# EAGLE design Top (EAGLE 6.1)
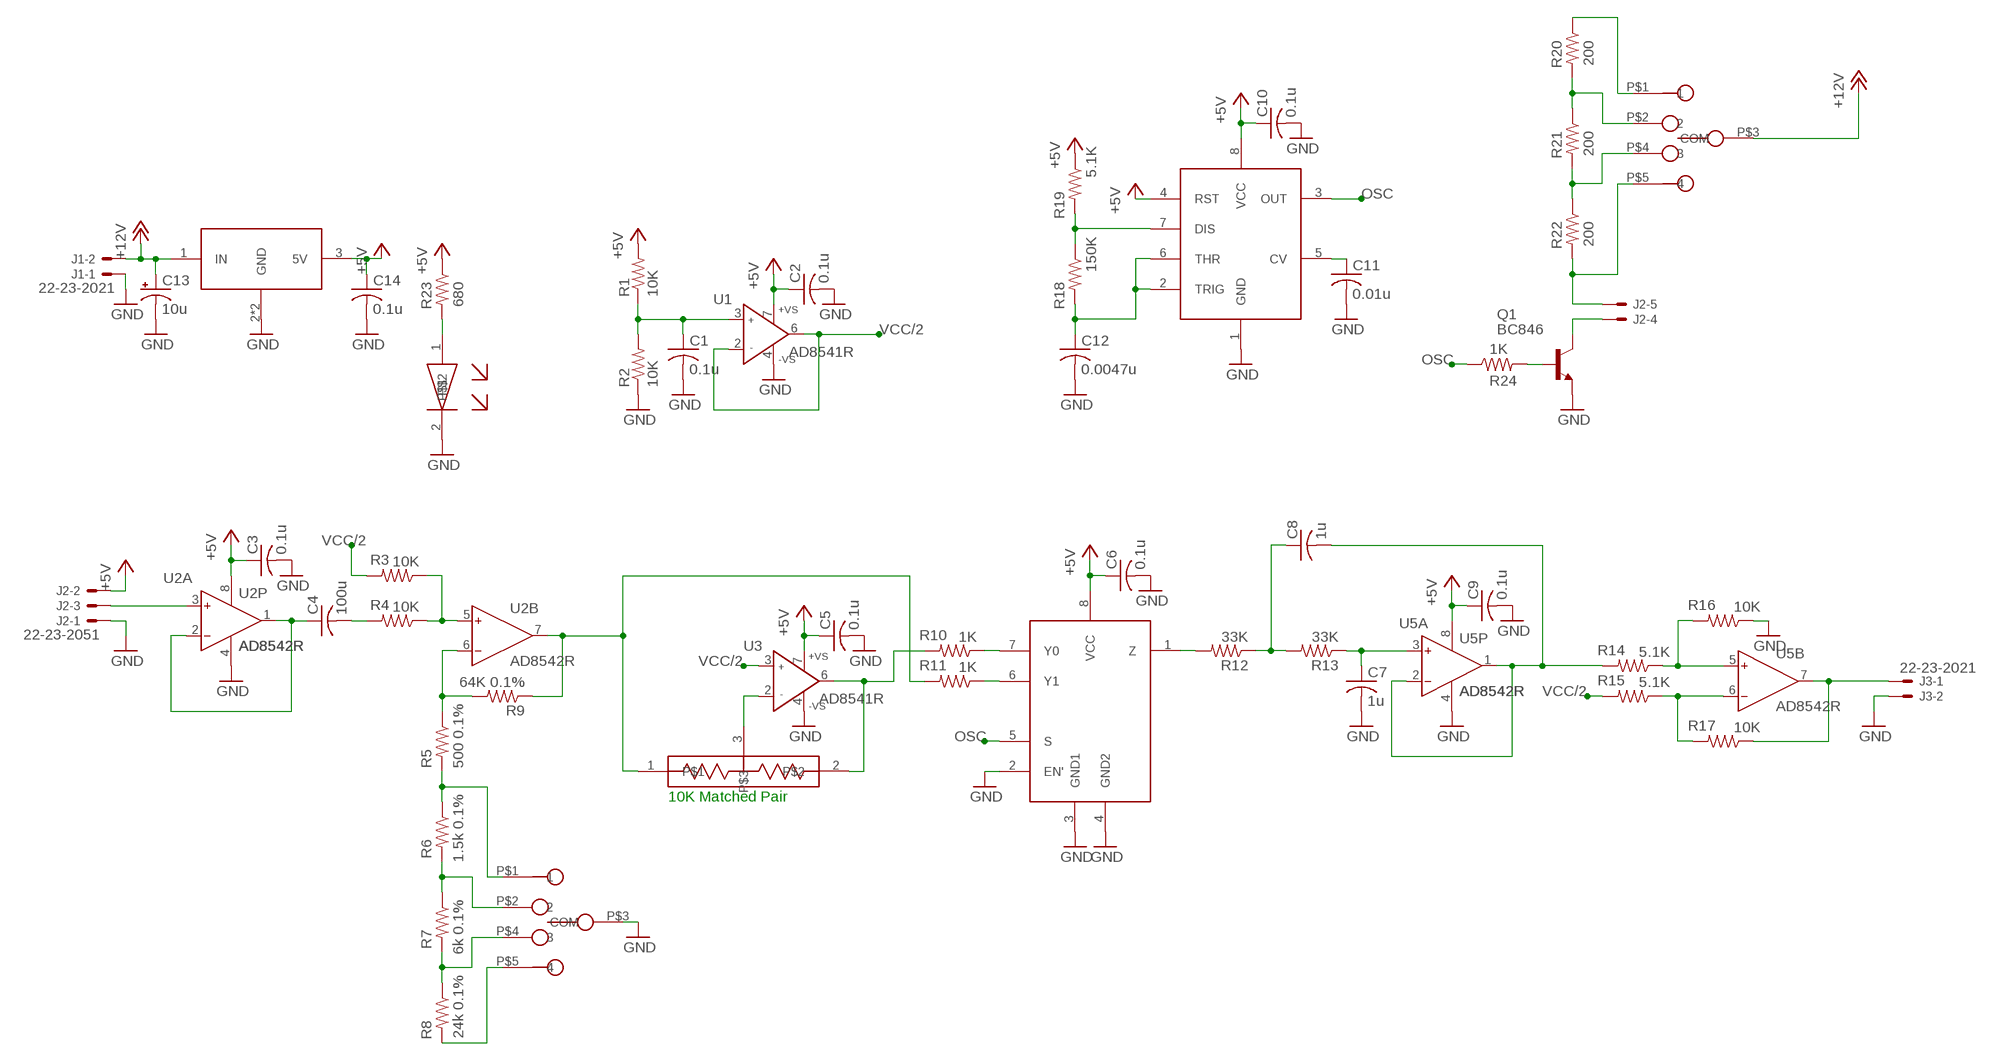
[diagram p0: schematic, sheet 1]

## Parts
C1  0.1u  C-USC0805  [C0805]
C2  0.1u  C-USC0805  [C0805]
C3  0.1u  C-USC0805  [C0805]
C4  100u  C-USC1206  [C1206]
C5  0.1u  C-USC0805  [C0805]
C6  0.1u  C-USC0805  [C0805]
C7  1u  C-USC0805  [C0805]
C8  1u  C-USC0805  [C0805]
C9  0.1u  C-USC0805  [C0805]
C10  0.1u  C-USC0805  [C0805]
C11  0.01u  C-USC0805  [C0805]
C12  0.0047u  C-USC0805  [C0805]
C13  10u  CPOL-USE2-5  [E2-5]
C14  0.1u  C-USC0805  [C0805]
D1  LGN971  [R1206]
J1  22-23-2021  [22-23-2021]
J2  22-23-2051  [22-23-2051]
J3  22-23-2021  [22-23-2021]
Q1  BC846  [SOT23]
R1  10K  R-US_R0805  [R0805]
R2  10K  R-US_R0805  [R0805]
R3  10K  R-US_R0805  [R0805]
R4  10K  R-US_R0805  [R0805]
R5  500 0.1%  R-US_R0805  [R0805]
R6  1.5k 0.1%  R-US_R0805  [R0805]
R7  6k 0.1%  R-US_R0805  [R0805]
R8  24k 0.1%  R-US_R0805  [R0805]
R9  64K 0.1%  R-US_R0805  [R0805]
R10  1K  R-US_R0805  [R0805]
R11  1K  R-US_R0805  [R0805]
R12  33K  R-US_R0805  [R0805]
R13  33K  R-US_R0805  [R0805]
R14  5.1K  R-US_R0805  [R0805]
R15  5.1K  R-US_R0805  [R0805]
R16  10K  R-US_R0805  [R0805]
R17  10K  R-US_R0805  [R0805]
R18  150K  R-US_R0805  [R0805]
R19  5.1K  R-US_R0805  [R0805]
R20  200  R-US_R0805  [R0805]
R21  200  R-US_R0805  [R0805]
R22  200  R-US_R0805  [R0805]
R23  680  R-US_R0805  [R0805]
R24  1K  R-US_R0805  [R0805]
RN1  MPMT2002  [SOT23]
SW1  STS1400  [2-3SW]
SW2  STS1400  [2-3SW]
U1  AD8541R  [SO8]
U2  AD8542R  [SO8]
U3  AD8541R  [SO8]
U4  74LVC1G53  [SOP08]
U5  AD8542R  [SO8]
U6  NA555  [SO8]
U7  UA78M05CDCYR  [SOT223-W]

## Nets
+5V: C2.1 C3.1 C5.1 C6.1 C9.1 C10.1 C14.1 J2.2 R1.2 R19.1 R23.1 U1.7(+VS) U2.8(P:V+) U3.7(+VS) U4.8(VCC) U5.8(P:V+) U6.4(RST) U6.8(VCC) U7.3(5V)
+12V: C13.+ J1.2 SW2.P$3(COM) U7.1(IN)
GND: C1.2 C2.2 C3.2 C5.2 C6.2 C7.2 C9.2 C10.2 C11.2 C12.2 C13.- C14.2 D1.2 J1.1 J2.1 J3.2 Q1.2(E) R2.1 R16.1 SW1.P$3(COM) U1.4(-VS) U2.4(P:V-) U3.4(-VS) U4.2(EN') U4.3(GND1) U4.4(GND2) U5.4(P:V-) U6.1(GND) U7.2(GND) U7.4(GND)
N$1: C1.1 R1.1 R2.2 U1.3(IN+)
N$2: C4.1 U2.1(A:OUT) U2.2(A:IN-)
N$3: C4.2 R4.2
N$4: R3.1 R4.1 U2.5(B:IN+)
N$5: R5.1 R9.2 U2.6(B:IN-)
N$6: R9.1 R11.2 RN1.1 U2.7(B:OUT)
N$7: R7.2 R8.1 SW1.P$4
N$8: R6.2 R7.1 SW1.P$2
N$9: R5.2 R6.1 SW1.P$1
N$10: RN1.3 U3.2(IN-)
N$11: R10.2 RN1.2 U3.6(OUT)
N$12: R10.1 U4.7(Y0)
N$13: R11.1 U4.6(Y1)
N$14: C8.1 R12.1 R13.2
N$15: C7.1 R13.1 U5.3(A:IN+)
N$16: C8.2 R14.2 U5.1(A:OUT) U5.2(A:IN-)
N$17: R18.1 R19.2 U6.7(DIS)
N$18: R14.1 R16.2 U5.5(B:IN+)
N$19: R15.1 R17.2 U5.6(B:IN-)
N$20: J3.1 R17.1 U5.7(B:OUT)
N$21: D1.1 R23.2
N$22: R12.2 U4.1(Z)
N$23: C12.1 R18.2 U6.2(TRIG) U6.6(THR)
N$24: Q1.1(B) R24.2
N$25: J2.5 R22.2 SW2.P$5
N$26: C11.1 U6.5(CV)
N$27: J2.4 Q1.3(C)
N$28: J2.3 U2.3(A:IN+)
N$29: R8.2 SW1.P$5
N$30: R21.2 R22.1 SW2.P$4
N$31: R20.2 R21.1 SW2.P$2
N$32: R20.1 SW2.P$1
OSC: R24.1 U4.5(S) U6.3(OUT)
VCC/2: R3.2 R15.2 U1.2(IN-) U1.6(OUT) U3.3(IN+)

## Notes on the sheet
- 10K Matched Pair

## Library data of the parts
C1-C12 C14 = rcl:C-US: CAPACITOR, American symbol
C13 = rcl:CPOL-US: POLARIZED CAPACITOR, American symbol
D1 = main:LGN971
J1 J3 = con-molex:22-23-2021: .100" (2.54mm) Center Header - 2 Pin; MF: MOLEX; MPN: 22-23-2021; OC_FARNELL: 1462926; OC_NEWARK: 25C3832
J2 = con-molex:22-23-2051: .100" (2.54mm) Center Header - 5 Pin; MF: MOLEX; MPN: 22-23-2051; OC_FARNELL: 1462952; OC_NEWARK: 38C9178
Q1 = transistor:BC846: NPN TRANSISTOR
R1-R24 = rcl:R-US_: RESISTOR, American symbol
RN1 = main:MPMT2002
SW1 SW2 = main:STS1400
U1 U3 = main:AD8541: General-Purpose CMOS Rail-to-Rail Amplifiers Source: http://www.analog.com/static/imported-files/data_sheets/AD8541_8542_8544.pdf; MPN: AD8541ARZ; OC_FARNELL: 9603859; OC_NEWARK: 31M4547
U2 U5 = main:AD8542: General-Purpose CMOS Rail-to-Rail Amplifiers Source: http://www.analog.com/static/imported-files/data_sheets/AD8541_8542_8544.pdf; MF: ALTERA CORPORATION; MPN: AD8542ARZ-REEL; OC_FARNELL: 1424150; OC_NEWARK: 59K6827
U4 = main:74LVC1G53
U6 = main:NA555
U7 = main:UA78M05CDCYR

## Board
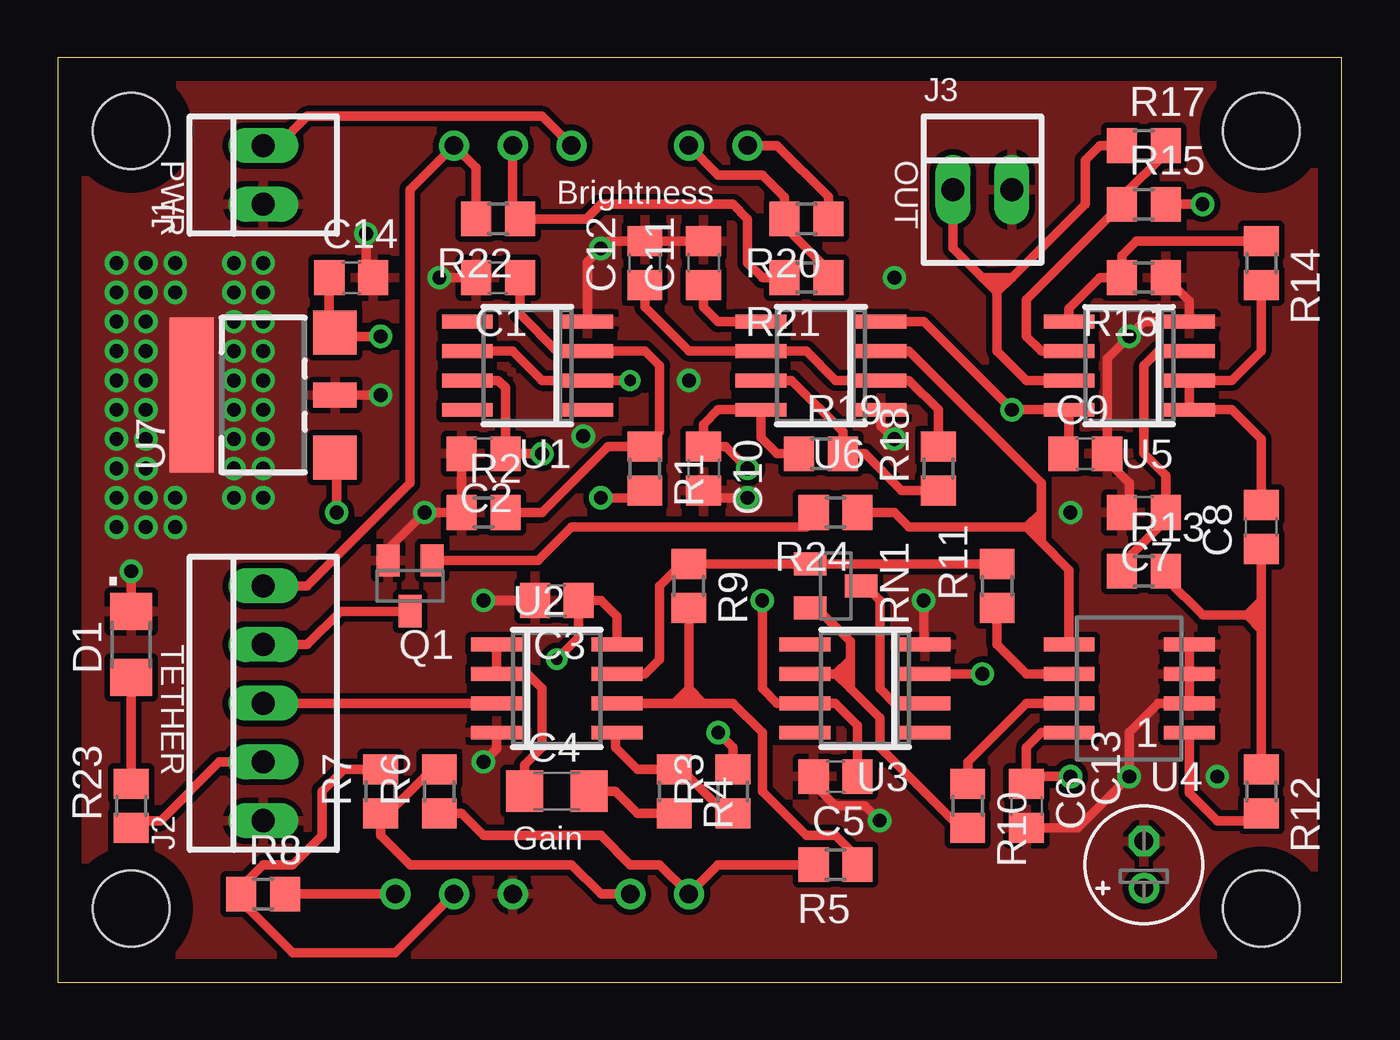
[diagram p1: board, top side]
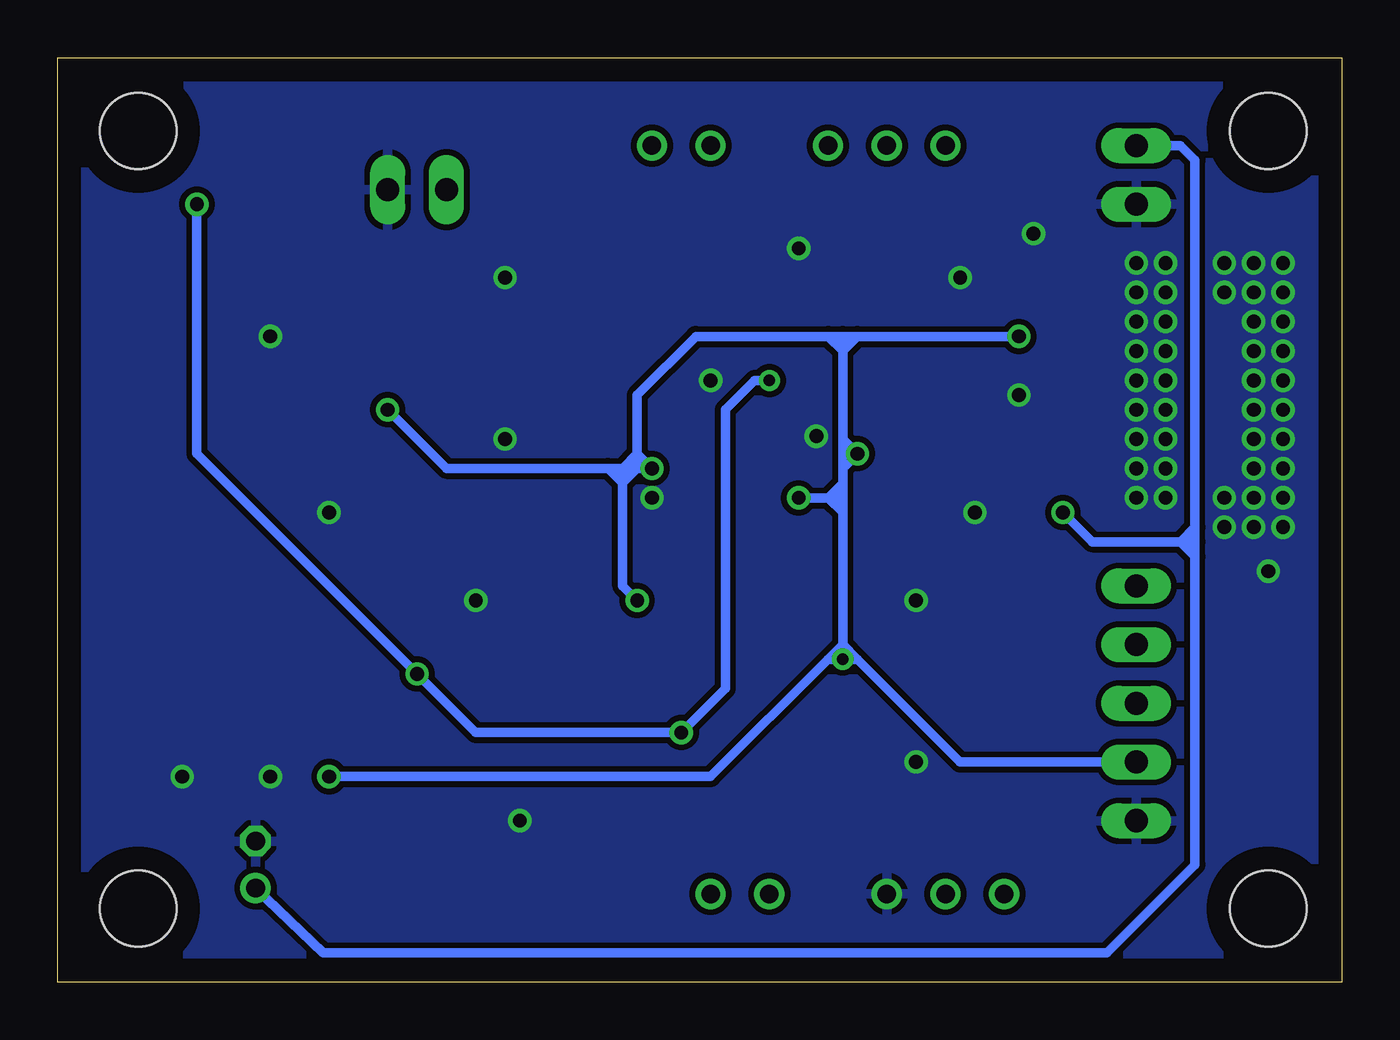
[diagram p2: board, bottom side, seen from below]

Size 55.55 x 39.99 mm. Coordinates in mm from the lower left corner, seen from the top.
Outline: 0,0 55.55,0 55.55,39.99 0,39.99 0,0
Copper layers (1*16): Top 0.035mm / dielectric 1.5mm / Bottom 0.035mm
Design rules "default *": minimum track width 10mil, minimum drill 15mil, track to track 8mil, track to pad 8mil, pad to pad 8mil, via to via 8mil, smd to smd 8mil, copper to edge 40mil, drill to drill 8mil, minimum pad ring 10mil, minimum via ring 8mil, stop-mask expansion 4mil, vias tented up to drill 0mil, thermal gap 10mil

### Footprints (pad centres in the part's own frame; a part is rotated, then mirrored left to right if it is on the bottom)
C0805 = smd 1.3 x 1.5: 1 -0.95,0; 2 0.95,0
C1206 = smd 1.6 x 1.8: 1 -1.4,0; 2 1.4,0
E2-5 = drill 0.813 pad 1.27: + -1.016,0 | drill 0.813 pad 1.27 octagon: - 1.016,0
R1206 = smd 1.6 x 1.803: 1 -1.422,0; 2 1.422,0
22-23-2021 = drill 1 long: 1 -1.27,0; 2 1.27,0
22-23-2051 = drill 1 long: 1 -5.08,0; 2 -2.54,0; 3 0,0; 4 2.54,0; 5 5.08,0
SOT23 = smd 1 x 1.4: 1 -0.95,-1.1; 2 0.95,-1.1; 3 0,1.1
R0805 = smd 1.3 x 1.5: 1 -0.95,0; 2 0.95,0
2-3SW = drill 0.8: P$1 0,0; P$2 2.54,0; P$3 7.62,0; P$4 10.16,0; P$5 12.7,0
SO8 = smd 0.6 x 2.2: 1 -1.905,-2.6; 2 -0.635,-2.6; 3 0.635,-2.6; 4 1.905,-2.6; 5 1.905,2.6; 6 0.635,2.6; 7 -0.635,2.6; 8 -1.905,2.6
SOP08 = smd 0.6 x 2.2: 1 -1.905,-2.6; 2 -0.635,-2.6; 3 0.635,-2.6; 4 1.905,-2.6; 5 1.905,2.6; 6 0.635,2.6; 7 -0.635,2.6; 8 -1.905,2.6
SOT223-W = smd 1.9 x 1.9: 1 -2.7,-3.1; 3 2.7,-3.1 | smd 1.1 x 1.9: 2 0,-3.1 | smd 6.7 x 1.9: 4 0,3.1
STAND-OFF = hole 3.302: 0,0

### Placement (x,y rotation side)
C1  19.05,30.48 180 top
C2  18.41,22.86 180 top
C3  21.59,16.51 180 top
C4  21.59,8.26 0 top
C5  33.66,8.89 180 top
C6  41.91,7.62 270 top
C7  46.99,20.32 180 top
C8  52.07,19.68 90 top
C9  44.45,22.86 0 top
C10  27.94,22.23 270 top
C11  27.94,31.11 90 top
C12  25.4,31.11 90 top
C13  46.99,5.08 90 top
C14  12.7,30.48 0 top
D1  3.17,14.61 90 top
J1  8.89,34.92 90 top
J2  8.89,12.06 90 top
J3  40.01,34.29 0 top
Q1  15.24,17.14 180 top
R1  25.4,22.23 270 top
R2  18.41,20.32 0 top
R3  29.21,8.26 90 top
R4  26.67,8.26 270 top
R5  33.66,5.08 180 top
R6  16.51,8.26 90 top
R7  13.97,8.26 90 top
R8  8.89,3.81 0 top
R9  27.3,17.14 270 top
R10  39.37,7.62 270 top
R11  40.64,17.14 90 top
R12  52.07,8.26 270 top
R13  46.99,17.78 0 top
R14  52.07,31.11 270 top
R15  46.99,33.66 0 top
R16  46.99,30.48 180 top
R17  46.99,36.2 0 top
R18  38.1,22.23 90 top
R19  33.02,22.86 0 top
R20  32.38,33.02 180 top
R21  32.38,30.48 180 top
R22  19.05,33.02 180 top
R23  3.17,7.62 90 top
R24  33.66,20.32 180 top
RN1  33.66,17.14 270 top
SW1  27.3,3.81 180 top
SW2  29.84,36.2 180 top
U1  20.32,26.67 90 top
U2  21.59,12.7 270 top
U3  34.92,12.7 90 top
U4  46.35,12.7 90 top
U5  46.35,26.67 90 top
U6  33.02,26.67 90 top
U7  8.89,25.4 90 top
U$1  [STAND-OFF]  3.17,3.17 0 top
U$2  [STAND-OFF]  3.17,36.83 0 top
U$3  [STAND-OFF]  52.07,36.83 0 top
U$4  [STAND-OFF]  52.07,3.17 0 top

### Tracks (layer width: path | path; a pad name or v marks a point on that pad's centre or on a via)
+5V  (via drill 0.51, 0.6)
  Top 0.406: U2.8 24.19,15.81 23.5,16.51 C3.1 | C3.1 22.23,16.51 | C5.1 34.6,11.12 33.66,12.06 U3.7 31.11,12.06 30.48,12.7 v30.48,16.51 | C9.1 43.76,23.11 U5.8 v41.27,24.77 37.47,28.57 U6.4 | U1.7 19.05,26.04 19.36,25.72 C2.1 v20.95,22.86 | C14.1 11.75,28.25 12.06,27.94 | R19.1 31.11,22.86 30.42,23.55 U6.8 28.57,24.77 27.94,24.13 C10.1 28.89,23.18 v29.84,22.23 | R1.2 25.08,20.95 v23.5,20.95 | C3.1 22.54,14.92 v21.59,13.97 | v43.81,8.89 42.23,8.89 C6.1 41.91,10.16 42.55,10.79 U4.8 43.81,10.79 | R23.1 3.49,6.99 4.45,6.99 6.99,9.53 J2.2 | v13.97,27.94 12.06,27.94 | 12.06,27.94 12.06,28.02 U7.3
  Bottom 0.406: 21.59,14.61 20.95,13.97 | 20.95,13.97 16.51,9.53 J2.2 | v41.27,24.77 38.73,22.23 31.75,22.23 | 31.75,22.23 31.11,22.23 | 31.11,22.23 30.48,22.23 | 30.48,22.23 v29.84,22.23 30.48,22.86 | v43.81,8.89 27.3,8.89 22.23,13.97 | 22.23,13.97 21.59,14.61 | 22.23,27.94 27.94,27.94 30.48,25.4 30.48,22.86 | 22.23,27.94 21.59,27.94 | 21.59,27.94 20.95,27.94 | 20.95,27.94 v13.97,27.94 | 21.59,14.61 21.59,20.32 | 21.59,20.32 21.59,20.95 | 21.59,20.95 21.59,21.59 | v23.5,20.95 22.23,20.95 | 22.23,20.95 21.59,20.95 | 21.59,21.59 22.23,20.95 | 21.59,20.32 22.23,20.95 | 21.59,21.59 21.59,22.23 | 21.59,22.23 21.59,22.86 | 21.59,22.86 21.59,23.5 | 21.59,23.5 21.59,27.3 | 21.59,27.3 21.59,27.94 | v20.95,22.86 21.59,22.86 | v20.95,22.86 21.59,23.5 | 21.59,22.23 v20.95,22.86 | 20.95,27.94 21.59,27.3 | 22.23,27.94 21.59,27.3 | 21.59,14.61 v21.59,13.97 | 20.95,13.97 v21.59,13.97 | v21.59,13.97 22.23,13.97 | 31.11,22.23 30.48,22.86 | v30.48,16.51 31.11,17.14 31.11,21.59 | 31.11,21.59 31.11,22.23 | 30.48,22.86 30.48,22.23 | 30.48,22.23 31.11,21.59 | 31.11,21.59 31.75,22.23
+12V  (via drill 0.6)
  Top 0.406: SW2.P$3 20.95,37.47 10.79,37.47 9.53,36.2 J1.2 | U7.1 12.06,22.7 v12.06,20.32
  Bottom 0.406: C13.+ 44.07,1.27 10.16,1.27 6.35,5.08 6.35,18.41 | 6.35,18.41 6.35,19.05 | 6.35,19.05 6.35,19.68 | 6.35,19.68 6.35,35.56 6.99,36.2 J1.2 | v12.06,20.32 10.79,19.05 6.99,19.05 | 6.99,19.05 6.35,19.05 | 6.35,19.68 6.99,19.05 | 6.99,19.05 6.35,18.41
GND  (via drill 0.6)
  Top 0.406: U4.4 U4.3 U4.2 47.62,12.06 46.35,10.79 v46.35,8.89 44.13,6.67 C6.2 | R16.1 48.95,29.46 U5.4 46.99,28.57 v46.35,27.94 45.4,26.98 C9.2 45.4,22.55 46.35,21.59 46.35,20.64 C7.2 | C11.2 C12.2 23.81,32.06 v23.5,31.75 22.92,31.18 U1.4 | C1.2 v16.51,30.48 | Q1.2 14.29,18.73 v15.88,20.32 R2.1 17.46,20.64 | C2.2 17.46,20.64 | 17.46,20.64 17.78,20.32 | U2.4 18.99,10.1 v18.41,9.53 | C3.2 v18.41,16.51 | U6.1 35.62,24.07 v36.2,23.5 | C10.2 28.26,20.95 v29.84,20.95 | U3.4 37.47,14.66 v37.47,16.51 | C5.2 32.7,8.57 33.66,7.62 34.92,7.62 v35.56,6.99 | U7.2 v13.97,25.4 | D1.2 v3.17,17.78 | C14.2 13.34,30.8 v13.34,32.38
  other vias: 2.54,31.11 3.81,31.11 7.62,31.11 8.89,31.11 8.89,29.84 7.62,29.84 7.62,28.57 8.89,28.57 7.62,27.3 8.89,27.3 7.62,26.04 8.89,26.04 7.62,24.77 8.89,24.77 8.89,23.5 7.62,23.5 7.62,22.23 8.89,22.23 8.89,20.95 7.62,20.95 8.89,20.95 7.62,20.95 5.08,20.95 5.08,19.68 3.81,19.68 2.54,19.68 2.54,20.95 3.81,20.95 3.81,22.23 2.54,22.23 2.54,23.5 3.81,23.5 3.81,24.77 2.54,24.77 2.54,26.04 3.81,26.04 3.81,27.3 2.54,27.3 2.54,28.57 3.81,28.57 2.54,29.84 3.81,29.84 5.08,29.84 5.08,31.11 27.3,26.04 36.2,30.48 43.81,20.32 50.16,8.89 22.73,23.62
  pour Bottom (isolate 0.254): 0,40.01 0,0 55.24,0 55.24,40.01
  pour Top (no thermals): 1.91,31.75 10.16,31.75 10.16,20.32 8.89,19.05 1.91,19.05
  pour Top (isolate 0.254): 0,40.01 0,0 55.24,0 55.24,40.01
N$1
  Top 0.406: U1.3 25.4,27.3 26.04,26.67 26.04,23.81 R1.1 23.81,23.18 20.95,20.32 R2.2 | U1.3 22.86,27.3 | U1.3 21.59,27.3 20,28.89 C1.1
N$2
  Top 0.406: U2.1 U2.2 20.32,13.34 20.95,12.7 20.95,10.16 20.19,9.39 C4.1
N$3
  Top 0.406: R4.2 25.08,7.3 24.13,8.26 C4.2
N$4
  Top 0.406: U2.5 24.13,10.73 24.13,10.16 25.09,9.21 R4.1 26.99,9.21 28.89,7.3 R3.1
N$5
  Top 0.406: R9.2 27.3,12.7 | 27.3,12.7 27.3,12.06 | 24.13,12.06 U2.6 26.67,12.06 | 26.67,12.06 27.3,12.06 | 27.3,12.06 27.94,12.06 | 27.94,12.06 29.21,12.06 30.48,10.79 30.48,8.26 32.38,6.35 33.66,6.35 34.6,5.4 R5.1 | 27.3,12.7 26.67,12.06 | 27.3,12.7 27.94,12.06
N$6
  Top 0.406: R11.2 RN1.1 R9.1 26.98,18.09 26.04,17.14 26.04,13.97 25.4,13.34 U2.7 24.13,13.34
N$7
  Top 0.406: SW1.P$4 14.61,1.27 10.16,1.27 8.26,3.17 8.26,3.5 R8.1 7.62,3.81 8.89,5.08 10.16,5.08 11.43,6.35 11.43,8.26 12.38,9.21 R7.2
N$8
  Top 0.406: R7.1 14.29,7.3 | 14.29,7.3 16.19,9.21 R6.2 | 14.29,7.3 13.97,6.99 13.97,6.35 15.24,5.08 22.23,5.08 23.5,3.81 SW1.P$2
N$9
  Top 0.406: R6.1 17.46,7.3 18.41,6.35 23.5,6.35 24.77,5.08 26.04,5.08 SW1.P$1 28.57,5.08 R5.2
N$10
  Top 0.406: U3.2 36.2,12.06 35.56,12.7 35.56,16.51 34.92,17.14 RN1.3
N$11
  Top 0.406: RN1.2 32.7,16.32 34.29,14.73 34.29,13.97 | 34.29,13.97 33.66,13.34 | U3.6 33.66,13.34 | 33.66,13.34 34.29,12.7 | 34.29,12.7 35.56,11.43 35.56,10.16 39.05,6.67 R10.2 | 34.29,13.97 34.29,13.34 | 34.29,13.34 34.29,12.7 | 34.29,13.34 33.66,13.34
N$12
  Top 0.406: U4.7 41.91,12.06 39.37,9.53 R10.1
N$13
  Top 0.406: U4.6 41.91,13.34 40.64,14.61 R11.1 40.64,16.51
N$14
  Top 0.406: R12.1 52.07,15.24 | 52.07,15.24 52.07,15.88 | 52.07,15.88 52.07,16.51 | 52.07,16.51 C8.1 | R13.2 47.95,17.46 49.53,15.88 51.44,15.88 | 51.44,15.88 52.07,15.88 | 52.07,16.51 51.44,15.88 | 52.07,15.24 51.44,15.88
N$15
  Top 0.406: U5.3 47.62,27.3 46.99,26.67 46.99,22.86 47.94,21.91 C7.1 47.94,20 46.04,18.1 R13.1
N$16
  Top 0.406: C8.2 52.07,23.5 50.8,24.77 U5.1 U5.2 50.8,26.04 52.07,27.3 R14.2
N$17
  Top 0.406: U6.7 31.75,26.04 33.97,23.82 R19.2 34.92,22.86 36.51,21.27 R18.1
N$18
  Top 0.406: R14.1 46.67,32.06 46.04,31.43 R16.2 | U5.5 43.76,29.15 45.09,30.48 R16.2 | R16.2 46.35,30.48
N$19
  Top 0.406: R17.2 47.94,35.88 46.04,33.98 R15.1 41.91,29.52 41.91,27.94 42.55,27.3 U5.6 43.81,27.3
N$20
  Top 0.406: U5.7 41.91,26.04 40.64,27.3 40.64,29.84 | 40.64,29.84 41.27,30.48 | 41.27,30.48 44.45,33.66 44.45,35.56 45.09,36.2 R17.1 | J3.1 38.73,31.75 40.01,30.48 | 40.01,30.48 40.64,29.84 | 40.01,30.48 40.64,30.48 | 41.27,30.48 40.64,30.48 | 40.64,30.48 40.64,29.84
N$21
  Top 0.406: R23.2 D1.1 3.17,13.34
N$22
  Top 0.406: R12.2 51.75,6.99 50.16,6.99 48.95,8.2 U4.1
N$23
  Top 0.406: R18.2 38.1,24.77 36.83,26.04 U6.2 33.66,26.04 32.38,27.3 U6.6 27.3,27.3 25.4,29.21 C12.1
N$24
  Top 0.406: R24.2 33.02,20.32 32.38,19.68 22.23,19.68 20.79,18.25 Q1.1
N$25
  Top 0.406: R22.2 18.1,35.24 SW2.P$5 15.24,34.29 15.24,21.59 10.79,17.14 J2.5
N$26
  Top 0.406: U6.5 28.57,28.57 27.94,29.21 C11.1
N$27
  Top 0.406: Q1.3 12.23,16.05 10.79,14.61 J2.4
N$28
  Top 0.406: J2.3 U2.3 19.05,12.06
N$29
  Top 0.406: R8.2 SW1.P$5
N$30
  Top 0.406: SW2.P$4 19.68,33.66 20,33.34 R22.1 22.86,33.02 23.5,33.66 29.21,33.66 29.84,33.02 29.84,31.11 30.48,30.48 R21.2
N$31
  Top 0.406: SW2.P$2 28.57,34.92 30.48,34.92 31.43,33.97 R20.2 31.43,32.7 33.34,30.8 R21.1
N$32
  Top 0.406: SW2.P$1 31.11,36.2 33.34,33.98 R20.1
OSC
  Top 0.406: U4.5 43.76,17.84 42.55,19.05 | 42.55,19.05 42.55,19.68 | 42.55,19.68 42.55,20.32 | 42.55,20.32 42.55,21.59 36.83,27.3 U6.3 | 41.91,19.68 42.55,19.68 | 42.55,20.32 41.91,19.68 | 41.91,19.68 42.55,19.05 | 41.91,19.68 36.83,19.68 36.2,20.32 R24.1 34.29,20.32
VCC/2  (via drill 0.51, 0.6)
  Top 0.406: U1.6 19.68,27.3 20.95,26.04 U1.2 v24.77,26.04 23.5,26.04 | R3.2 29.21,10.16 v28.57,10.79 | U3.3 v40.01,13.34 | R15.2 v49.53,33.66
  Bottom 0.406: v49.53,33.66 49.53,22.86 v40.01,13.34 37.47,10.79 v28.57,10.79 26.67,12.7 26.67,24.77 25.4,26.04 v24.77,26.04

### Text on the board
tPlace: PWR | OUT | Brightness | . | TETHER | Gain